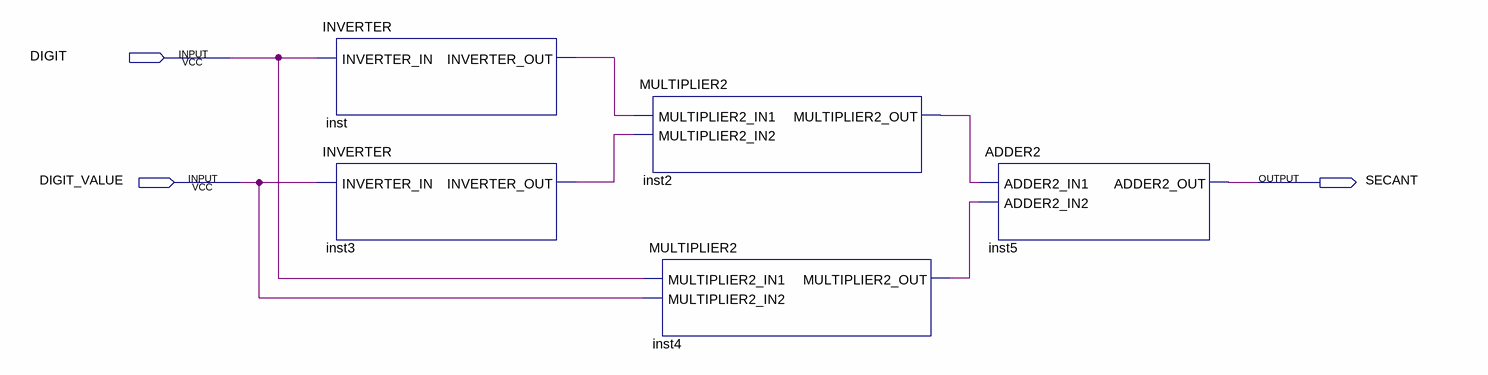
[diagram p0: schematic sheet]
// Quartus schematic SECANT.bdf as structural Verilog: 5 symbols, 3 pins
module SECANT (
  input  DIGIT,
  input  DIGIT_VALUE,
  output SECANT
);

  wire inst2_multiplier2_out, inst3_inverter_out, inst4_multiplier2_out, inst_inverter_out;

  INVERTER inst (.INVERTER_IN(DIGIT), .INVERTER_OUT(inst_inverter_out));
  INVERTER inst3 (.INVERTER_IN(DIGIT_VALUE), .INVERTER_OUT(inst3_inverter_out));
  MULTIPLIER2 inst2 (
    .MULTIPLIER2_IN1(inst_inverter_out), .MULTIPLIER2_IN2(inst3_inverter_out),
    .MULTIPLIER2_OUT(inst2_multiplier2_out));
  MULTIPLIER2 inst4 (.MULTIPLIER2_IN1(DIGIT), .MULTIPLIER2_IN2(DIGIT_VALUE), .MULTIPLIER2_OUT(inst4_multiplier2_out));
  ADDER2 inst5 (.ADDER2_IN1(inst2_multiplier2_out), .ADDER2_IN2(inst4_multiplier2_out), .ADDER2_OUT(SECANT));
endmodule
